# EAGLE board HSI-interface-2 (EAGLE 7.6.0)
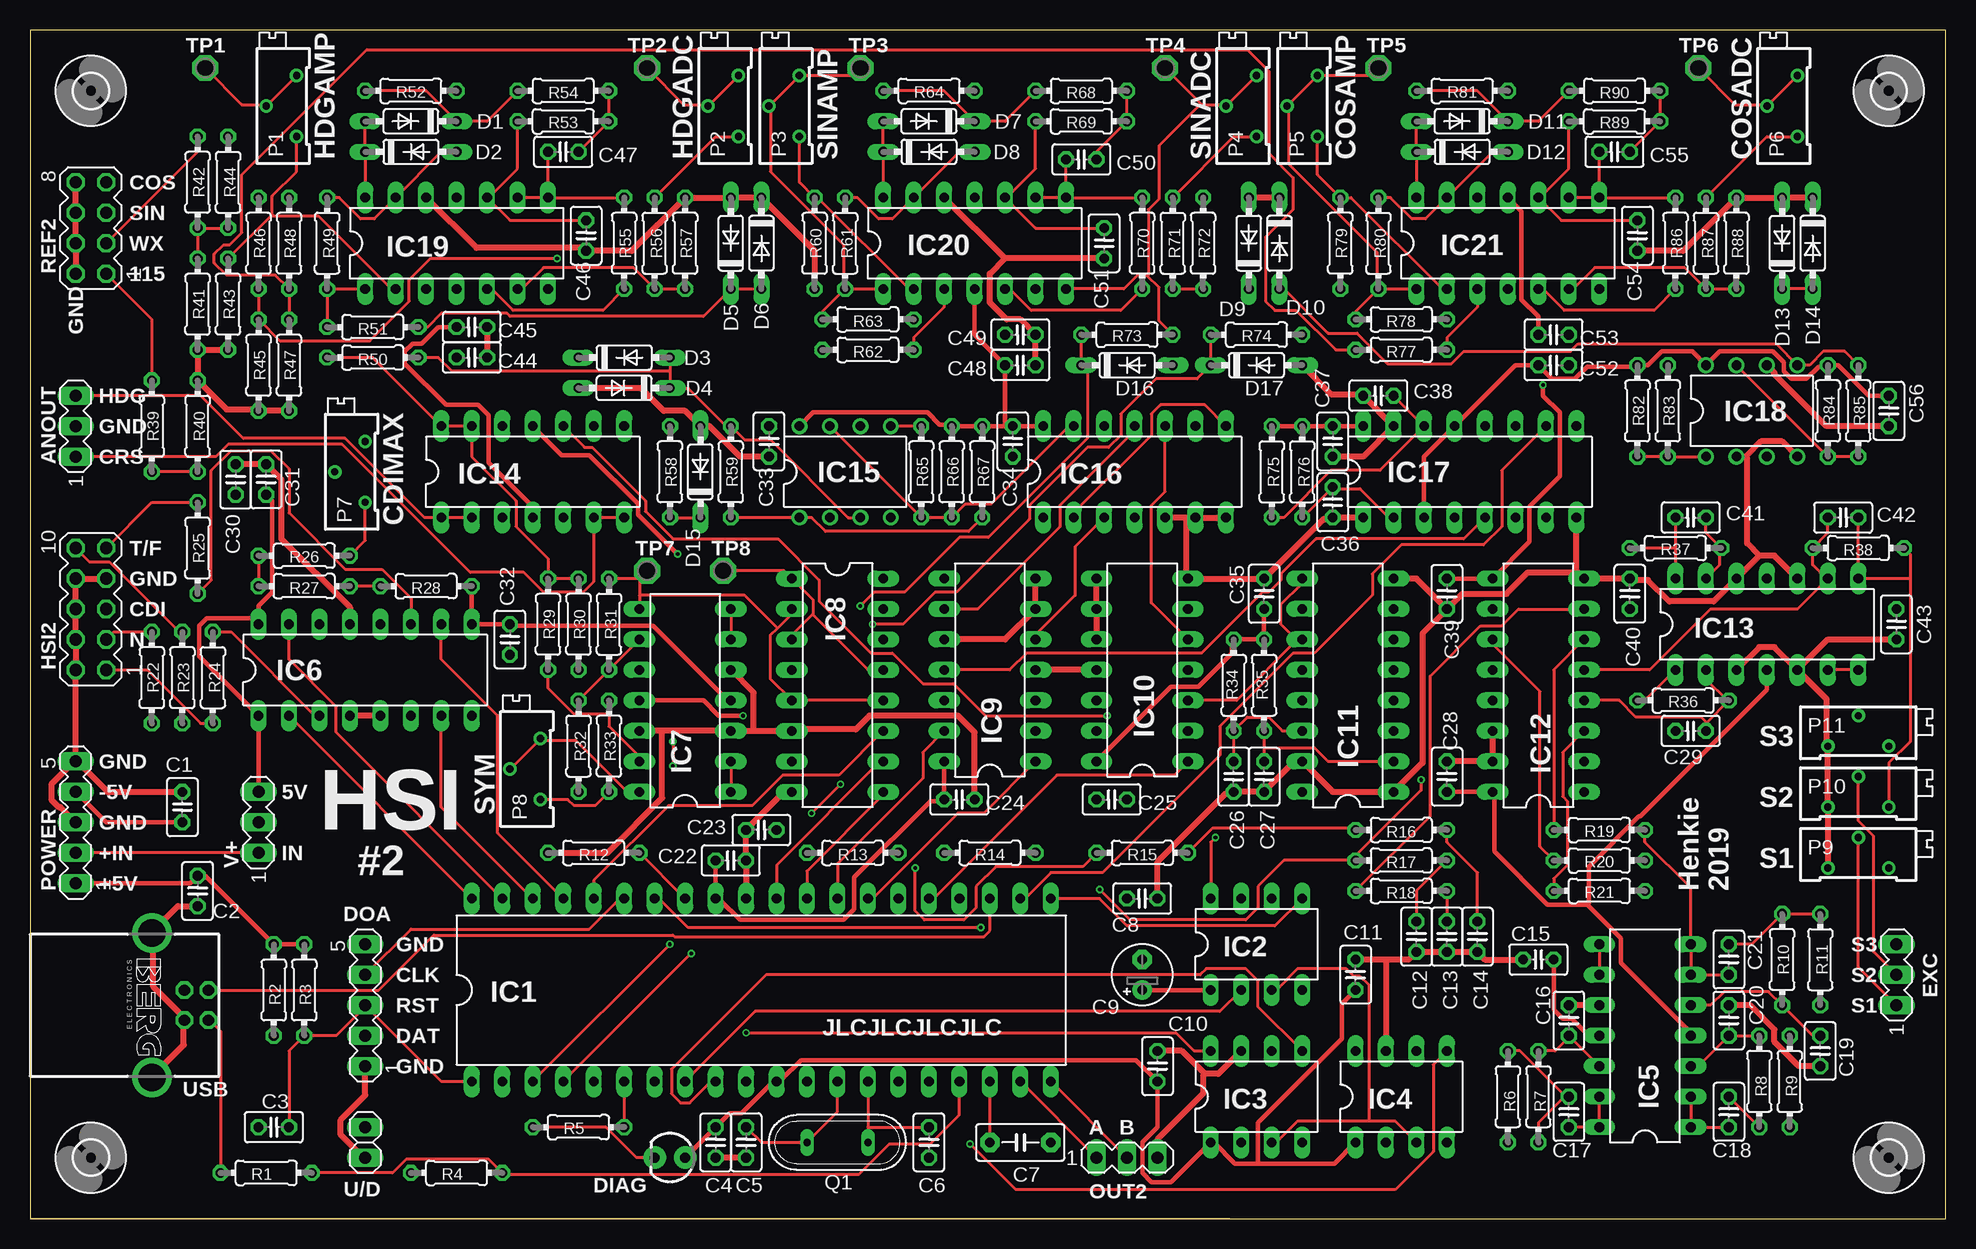
[diagram p7: board, top side]
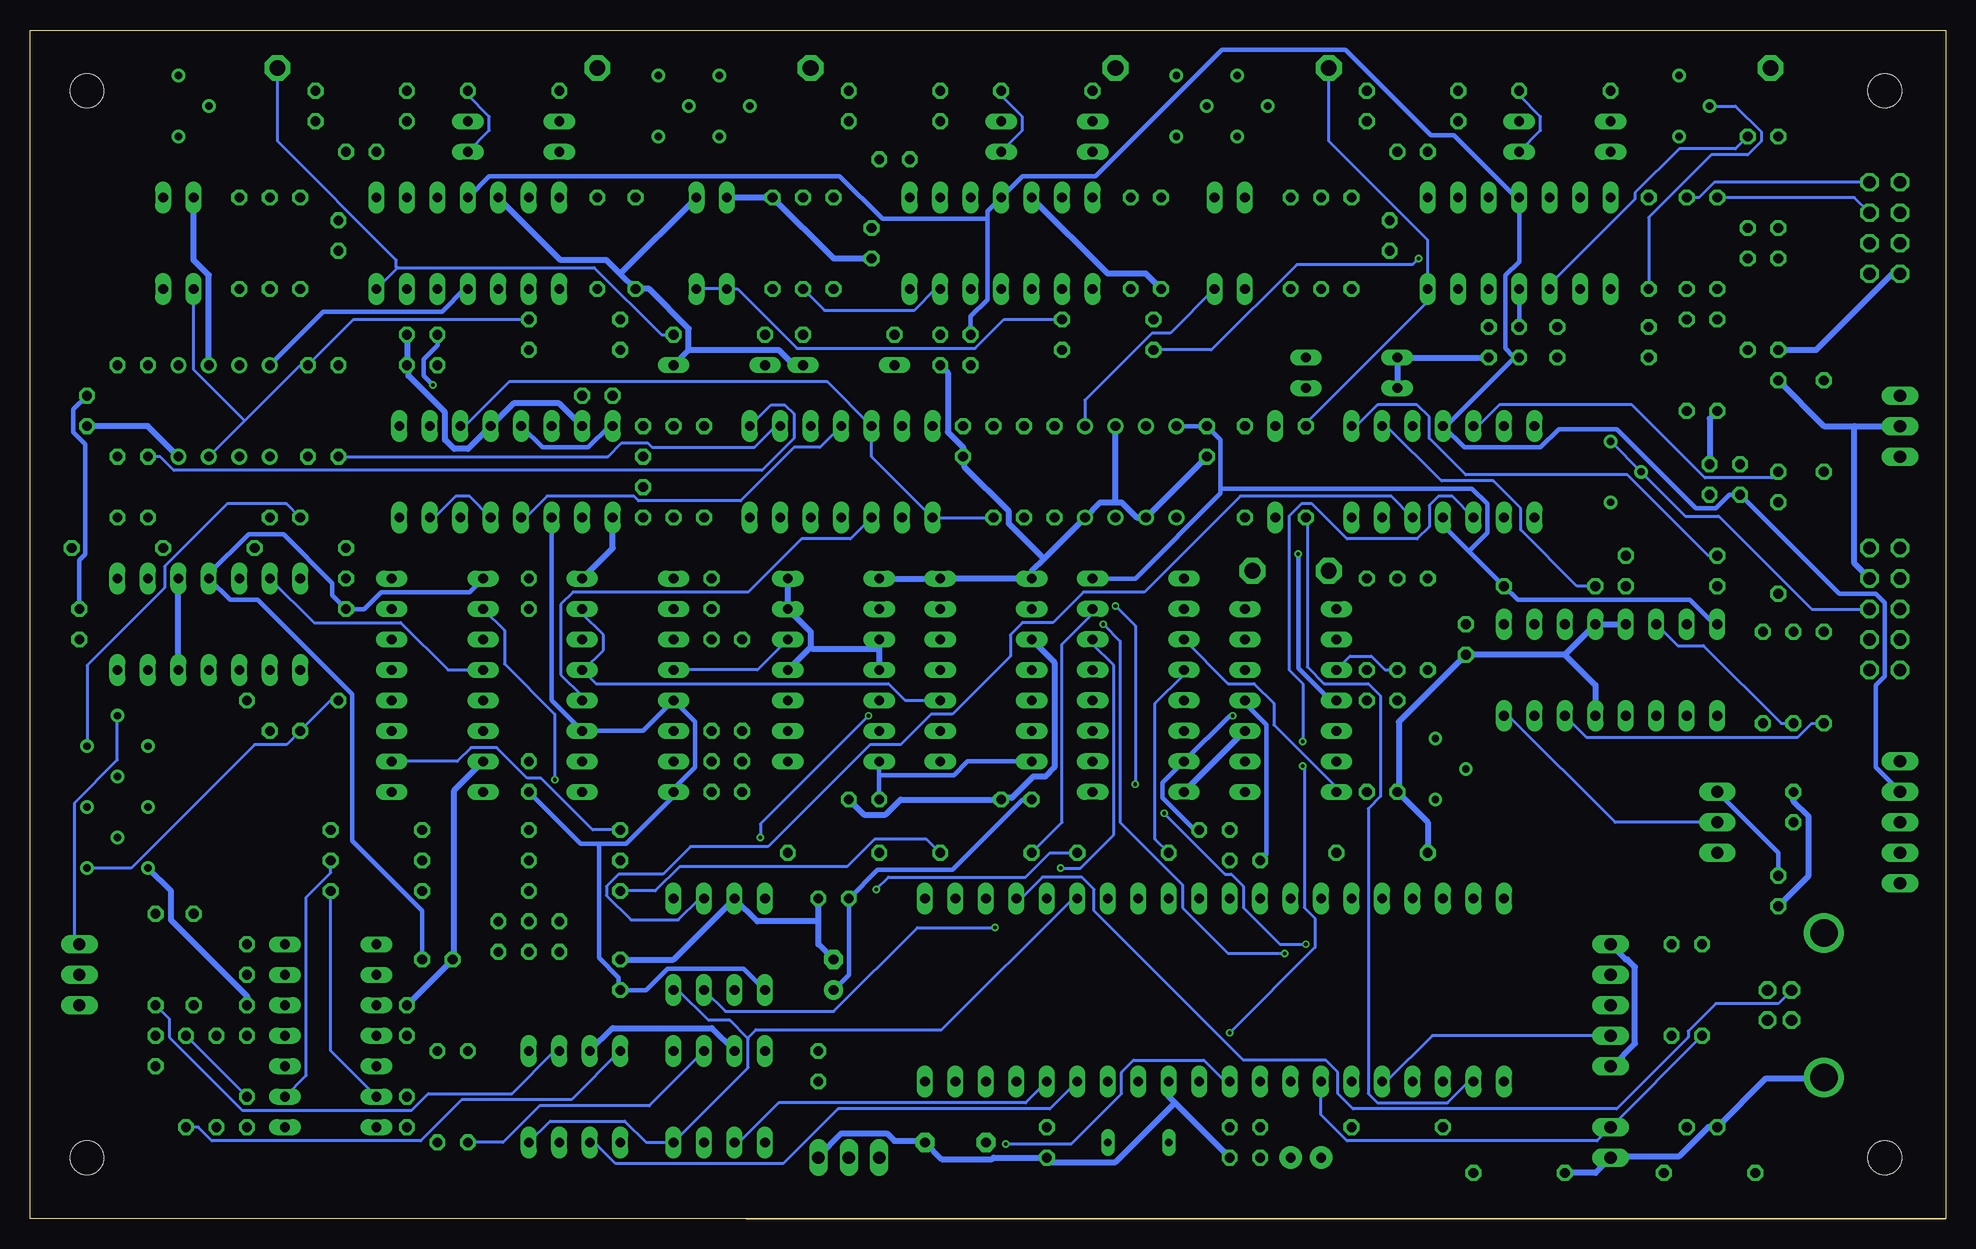
[diagram p8: board, bottom side, seen from below]

Size 159.69 x 99.06 mm. Coordinates in mm from the lower left corner, seen from the top.
Outline: 100,0 0,0
Outline: 0,0.01 159.69,0.01 159.69,99.06 0,99.06 0,0.01
Copper layers (1*16): Top 0.035mm / dielectric 1.5mm / Bottom 0.035mm
Design rules "ITEADstudio_DRC": minimum track width 6mil, minimum drill 12mil, track to track 6mil, track to pad 6mil, pad to pad 6mil, via to via 6mil, smd to smd 0mil, copper to edge 10mil, drill to drill 10mil, minimum pad ring 10mil, minimum via ring 6mil, stop-mask expansion 2mil, vias tented up to drill 100mil, thermal gap 10mil
Net classes: 0 default: width 0.254 mm, drill 0.254 mm, clearance 0.254 mm; 1 ground: width 0.508 mm, drill 0.254 mm, clearance 0.254 mm; 2 +5V: width 0.381 mm, drill 0.254 mm, clearance 0.254 mm; 3 -5V: width 0.381 mm, drill 0.254 mm, clearance 0.254 mm; 4 +12V: width 0.381 mm, drill 0.254 mm, clearance 0.254 mm; 5 -12V: width 0.381 mm, drill 0.254 mm, clearance 0.254 mm; 6 HV115: width 0.381 mm, drill 0.381 mm, clearance 0.508 mm; 7 +24V: width 0.381 mm, drill 0.381 mm, clearance 0.254 mm; 8 VIN: width 0.381 mm, drill 0.381 mm, clearance 0.254 mm

## Footprints (pad centres in the part's own frame; a part is rotated, then mirrored left to right if it is on the bottom)
MA03-1 = drill 1.016 long: 1 -2.54,0; 2 0,0; 3 2.54,0
C025-025X050 = drill 0.813 octagon: 1 -1.27,0; 2 1.27,0
C5B3 = drill 0.813 pad 1.6 octagon: 1 -2.54,0; 2 2.54,0
E2,5-5 = drill 0.813 pad 1.6: + -1.27,0 | drill 0.813 pad 1.6 octagon: - 1.27,0
DO35-7 = drill 0.813 long: A 3.81,0; C -3.81,0
LED3MM = drill 0.813 pad 1.88: A -1.27,0; K 1.27,0
MA05-1 = drill 1.016 long: 1 -5.08,0; 2 -2.54,0; 3 0,0; 4 2.54,0; 5 5.08,0
2,8 = hole 2.8: 0,0
MA05-2 = drill 1.016 octagon: 1 -5.08,-1.27; 2 -5.08,1.27; 3 -2.54,-1.27; 4 -2.54,1.27; 5 0,-1.27; 6 0,1.27; 7 2.54,-1.27; 8 2.54,1.27; 9 5.08,-1.27; 10 5.08,1.27
DIL40 = drill 0.813 long: 1 -24.13,-7.62; 2 -21.59,-7.62; 3 -19.05,-7.62; 4 -16.51,-7.62; 5 -13.97,-7.62; 6 -11.43,-7.62; 7 -8.89,-7.62; 8 -6.35,-7.62; 9 -3.81,-7.62; 10 -1.27,-7.62; 11 1.27,-7.62; 12 3.81,-7.62; 13 6.35,-7.62; 14 8.89,-7.62; 15 11.43,-7.62; 16 13.97,-7.62; 17 16.51,-7.62; 18 19.05,-7.62; 19 21.59,-7.62; 20 24.13,-7.62; 21 24.13,7.62; 22 21.59,7.62; 23 19.05,7.62; 24 16.51,7.62; 25 13.97,7.62; 26 11.43,7.62; 27 8.89,7.62; 28 6.35,7.62; 29 3.81,7.62; 30 1.27,7.62; 31 -1.27,7.62; 32 -3.81,7.62; 33 -6.35,7.62; 34 -8.89,7.62; 35 -11.43,7.62; 36 -13.97,7.62; 37 -16.51,7.62; 38 -19.05,7.62; 39 -21.59,7.62; 40 -24.13,7.62
DIL08 = drill 0.813 long: 1 -3.81,-3.81; 2 -1.27,-3.81; 3 1.27,-3.81; 4 3.81,-3.81; 5 3.81,3.81; 6 1.27,3.81; 7 -1.27,3.81; 8 -3.81,3.81
DIL14 = drill 0.813 long: 1 -7.62,-3.81; 2 -5.08,-3.81; 3 -2.54,-3.81; 4 0,-3.81; 5 2.54,-3.81; 6 5.08,-3.81; 7 7.62,-3.81; 8 7.62,3.81; 9 5.08,3.81; 10 2.54,3.81; 11 0,3.81; 12 -2.54,3.81; 13 -5.08,3.81; 14 -7.62,3.81
DIL16 = drill 0.813 long: 1 -8.89,-3.81; 2 -6.35,-3.81; 3 -3.81,-3.81; 4 -1.27,-3.81; 5 1.27,-3.81; 6 3.81,-3.81; 7 6.35,-3.81; 8 8.89,-3.81; 9 8.89,3.81; 10 6.35,3.81; 11 3.81,3.81; 12 1.27,3.81; 13 -1.27,3.81; 14 -3.81,3.81; 15 -6.35,3.81; 16 -8.89,3.81
DIL08' = drill 0.813 pad 1.27: 1 -3.81,-3.81; 2 -1.27,-3.81; 3 1.27,-3.81; 4 3.81,-3.81; 5 3.81,3.81; 6 1.27,3.81; 7 -1.27,3.81; 8 -3.81,3.81
RTRIM64Z = drill 0.61: 1 0,-2.54; 2 -2.54,0; 3 0,2.54
QS = drill 0.61 long: 1 -2.54,0; 2 2.54,0
0204/7 = drill 0.813 octagon: 1 -3.81,0; 2 3.81,0
MA04-2 = drill 1.016 octagon: 1 -3.81,-1.27; 2 -3.81,1.27; 3 -1.27,-1.27; 4 -1.27,1.27; 5 1.27,-1.27; 6 1.27,1.27; 7 3.81,-1.27; 8 3.81,1.27
P1-13 = drill 1.321 pad 2.159 octagon: TP 0,0
1X02 = drill 1.016 long: 1 -1.27,0; 2 1.27,0
PN61729-S = drill 0.95 octagon: 1 1.25,4.71; 2 -1.25,4.71; 3 -1.25,2.71; 4 1.25,2.71 | drill 2.3 pad 2.9: S1 -6.02,0; S2 6.02,0

## Placement (x,y rotation side)
ANOUT  ANOUT  [MA03-1]  3.81,66.05 90 top
C1  100n  [C025-025X050]  12.7,34.3 270 top
C2  100n  [C025-025X050]  13.97,27.32 90 top
C3  100n  [C025-025X050]  20.32,7.63 0 top
C4  100n  [C025-025X050]  57.15,6.36 90 top
C5  18p  [C025-025X050]  59.69,6.36 90 top
C6  18p  [C025-025X050]  74.93,6.36 90 top
C7  220n  [C5B3]  82.55,6.36 0 top
C8  100n  [C025-025X050]  92.71,26.68 180 top
C9  10µF  [E2,5-5]  92.71,20.33 90 top
C10  100n  [C025-025X050]  93.98,12.71 270 top
C11  100n  [C025-025X050]  110.49,20.33 270 top
C12  560p  [C025-025X050]  115.57,23.51 270 top
C13  560p  [C025-025X050]  118.11,23.51 270 top
C14  560p  [C025-025X050]  120.65,23.51 270 top
C15  100n  [C025-025X050]  125.73,21.6 0 top
C16  470n  [C025-025X050]  128.27,16.52 90 top
C17  470n  [C025-025X050]  128.27,8.9 270 top
C18  470n  [C025-025X050]  141.6,8.9 270 top
C19  470n  [C025-025X050]  149.22,13.98 270 top
C20  470n  [C025-025X050]  141.6,16.52 90 top
C21  470n  [C025-025X050]  141.6,21.6 270 top
C22  100n  [C025-025X050]  58.42,29.86 180 top
C23  100n  [C025-025X050]  60.96,32.39 0 top
C24  100n  [C025-025X050]  77.47,34.93 180 top
C25  100n  [C025-025X050]  90.17,34.93 180 top
C26  100n  [C025-025X050]  100.33,36.84 270 top
C27  100n  [C025-025X050]  102.87,36.84 270 top
C28  100n  [C025-025X050]  118.11,36.84 270 top
C29  470p  [C025-025X050]  138.43,40.65 180 top
C30  100n  [C025-025X050]  17.14,61.6 90 top
C31  100n  [C025-025X050]  19.68,61.6 270 top
C32  100n  [C025-025X050]  40.01,48.27 90 top
C33  100n  [C025-025X050]  61.59,64.78 90 top
C34  100n  [C025-025X050]  81.92,64.78 90 top
C35  100n  [C025-025X050]  102.87,52.08 270 top
C36  100n  [C025-025X050]  108.58,59.7 270 top
C37  100n  [C025-025X050]  108.58,64.78 90 top
C38  100n  [C025-025X050]  112.39,68.59 180 top
C39  100n  [C025-025X050]  118.11,52.08 90 top
C40  100n  [C025-025X050]  133.35,52.08 270 top
C41  470p  [C025-025X050]  138.43,58.43 180 top
C42  470p  [C025-025X050]  151.13,58.43 0 top
C43  100n  [C025-025X050]  155.57,49.54 90 top
C44  100n  [C025-025X050]  36.83,71.77 180 top
C45  100n  [C025-025X050]  36.83,74.31 180 top
C46  100n  [C025-025X050]  46.35,81.93 90 top
C47  100n  [C025-025X050]  44.45,88.91 180 top
C48  100n  [C025-025X050]  82.55,71.13 180 top
C49  100n  [C025-025X050]  82.55,73.67 180 top
C50  100n  [C025-025X050]  87.63,88.28 180 top
C51  100n  [C025-025X050]  89.53,81.29 90 top
C52  100n  [C025-025X050]  127,71.13 180 top
C53  100n  [C025-025X050]  127,73.67 180 top
C54  100n  [C025-025X050]  133.99,81.93 90 top
C55  100n  [C025-025X050]  132.08,88.91 180 top
C56  100n  [C025-025X050]  154.94,67.32 90 top
D1  1N4148  [DO35-7]  31.75,91.45 180 top
D2  1N4148  [DO35-7]  31.75,88.91 0 top
D3  1N4148  [DO35-7]  49.53,71.77 0 top
D4  1N4148  [DO35-7]  49.53,69.23 180 top
D5  1N4148  [DO35-7]  58.42,81.29 90 top
D6  1N4148  [DO35-7]  60.96,81.29 270 top
D7  1N4148  [DO35-7]  74.93,91.45 180 top
D8  1N4148  [DO35-7]  74.93,88.91 0 top
D9  1N4148  [DO35-7]  101.6,81.29 90 top
D10  1N4148  [DO35-7]  104.14,81.29 270 top
D11  1N4148  [DO35-7]  119.38,91.45 180 top
D12  1N4148  [DO35-7]  119.38,88.91 0 top
D13  1N4148  [DO35-7]  146.05,81.29 90 top
D14  1N4148  [DO35-7]  148.59,81.29 270 top
D15  1N4148  [DO35-7]  55.88,62.24 90 top
D16  1N4148  [DO35-7]  91.44,71.13 0 top
D17  1N4148  [DO35-7]  102.23,71.13 0 top
DIAG  LED  [LED3MM]  53.34,5.09 180 top
DOA  DOA  [MA05-1]  27.94,17.79 90 top
EXC  EXC  [MA03-1]  155.57,20.33 90 top
H1  MOUNT-HOLE2.8  [2,8]  154.94,5.09 0 top
H2  MOUNT-HOLE2.8  [2,8]  5.08,5.09 0 top
H3  MOUNT-HOLE2.8  [2,8]  154.94,93.99 0 top
H4  MOUNT-HOLE2.8  [2,8]  5.08,93.99 0 top
HSI2  HSI2  [MA05-2]  5.08,50.81 90 top
IC1  PIC18F4550_40  [DIL40]  60.96,19.06 0 top
IC2  MCP4822-E/P  [DIL08]  102.23,22.87 0 top
IC3  MCP4822-E/P  [DIL08]  102.23,10.17 0 top
IC4  MCP4822-E/P  [DIL08]  114.3,10.17 0 top
IC5  LM6484  [DIL14]  134.62,15.25 90 top
IC6  L293D  [DIL16]  27.94,45.73 0 top
IC7  LM6484  [DIL14]  54.61,43.19 90 top
IC8  4053N  [DIL16]  67.31,44.46 270 top
IC9  4013N  [DIL14]  80.01,45.73 90 top
IC10  4013N  [DIL14]  92.71,45.73 90 top
IC11  4538N  [DIL16]  109.86,44.46 90 top
IC12  SSM2164P  [DIL16]  125.73,44.46 90 top
IC13  LM6484  [DIL14]  144.78,49.54 0 top
IC14  LM6484  [DIL14]  41.91,62.24 0 top
IC15  LM393N  [DIL08']  67.94,62.24 0 top
IC16  4070N  [DIL14]  92.08,62.24 0 top
IC17  4538N  [DIL16]  120.02,62.24 0 top
IC18  LM393N  [DIL08']  143.51,67.32 0 top
IC19  LM6484  [DIL14]  35.56,81.29 0 top
IC20  LM6484  [DIL14]  78.74,81.29 0 top
IC21  LM6484  [DIL14]  123.19,81.29 0 top
OUT2  OUT2  [MA03-1]  91.44,5.09 0 top
P1  5k  [RTRIM64Z]  22.23,92.72 0 top
P2  50k  [RTRIM64Z]  59.05,92.72 0 top
P3  5k  [RTRIM64Z]  64.14,92.72 0 top
P4  50k  [RTRIM64Z]  102.23,92.72 0 top
P5  5k  [RTRIM64Z]  107.31,92.72 0 top
P6  50k  [RTRIM64Z]  147.32,92.72 0 top
P7  50k  [RTRIM64Z]  27.94,62.24 0 top
P8  2k  [RTRIM64Z]  42.55,37.48 0 top
P9  20k  [RTRIM64Z]  152.4,29.22 270 top
P10  20k  [RTRIM64Z]  152.4,34.3 270 top
P11  20k  [RTRIM64Z]  152.4,39.38 270 top
POWER  POWER  [MA05-1]  3.81,33.03 90 top
Q1  20MHz  [QS]  67.31,6.36 180 top
R1  1k  [0204/7]  19.68,3.82 0 top
R2  10k  [0204/7]  20.32,19.06 90 top
R3  10k  [0204/7]  22.86,19.06 90 top
R4  100k  [0204/7]  35.56,3.82 0 top
R5  470  [0204/7]  45.72,7.63 0 top
R6  150k  [0204/7]  123.19,10.17 270 top
R7  150k  [0204/7]  125.73,10.17 270 top
R8  150k  [0204/7]  144.15,11.44 270 top
R9  150k  [0204/7]  146.69,11.44 270 top
R10  150k  [0204/7]  146.05,21.6 90 top
R11  150k  [0204/7]  149.22,21.6 270 top
R12  100k  [0204/7]  46.99,30.49 180 top
R13  47k  [0204/7]  68.58,30.49 180 top
R14  47k  [0204/7]  80.01,30.49 180 top
R15  47k  [0204/7]  92.71,30.49 180 top
R16  560  [0204/7]  114.3,32.39 180 top
R17  560  [0204/7]  114.3,29.86 180 top
R18  560  [0204/7]  114.3,27.32 180 top
R19  2k7  [0204/7]  130.81,32.39 0 top
R20  2k7  [0204/7]  130.81,29.86 0 top
R21  2k7  [0204/7]  130.81,27.32 0 top
R22  15k  [0204/7]  10.16,45.09 90 top
R23  6k8  [0204/7]  12.7,45.09 90 top
R24  0  [0204/7]  15.24,45.09 270 top
R25  8k2  [0204/7]  13.97,55.89 90 top
R26  4k7  [0204/7]  22.86,55.25 0 top
R27  10k  [0204/7]  22.86,52.71 180 top
R28  12k  [0204/7]  33.02,52.71 180 top
R29  1k  [0204/7]  43.18,49.54 90 top
R30  1k  [0204/7]  45.72,49.54 90 top
R31  1k2  [0204/7]  48.26,49.54 270 top
R32  1k  [0204/7]  45.72,39.38 270 top
R33  560  [0204/7]  48.26,39.38 90 top
R34  33k  [0204/7]  100.33,44.46 270 top
R35  33k  [0204/7]  102.87,44.46 270 top
R36  47k  [0204/7]  137.79,43.19 0 top
R37  47k  [0204/7]  137.16,55.89 0 top
R38  47k  [0204/7]  152.4,55.89 180 top
R39  330k  [0204/7]  10.16,66.05 90 top
R40  6k8  [0204/7]  13.97,66.05 270 top
R41  1k  [0204/7]  13.97,76.21 90 top
R42  33k  [0204/7]  13.97,86.37 90 top
R43  1k  [0204/7]  16.51,76.21 90 top
R44  1k  [0204/7]  16.51,86.37 270 top
R45  1k  [0204/7]  19.05,71.13 90 top
R46  33k  [0204/7]  19.05,81.29 90 top
R47  1k  [0204/7]  21.59,71.13 90 top
R48  33k  [0204/7]  21.59,81.29 90 top
R49  10k  [0204/7]  24.77,81.29 270 top
R50  10k  [0204/7]  28.57,71.77 180 top
R51  10k  [0204/7]  28.57,74.31 180 top
R52  10k  [0204/7]  31.75,93.99 0 top
R53  150k  [0204/7]  44.45,91.45 0 top
R54  150k  [0204/7]  44.45,93.99 180 top
R55  10k  [0204/7]  49.53,81.29 90 top
R56  10k  [0204/7]  52.07,81.29 270 top
R57  10k  [0204/7]  54.61,81.29 90 top
R58  1k  [0204/7]  53.34,62.24 90 top
R59  2M2  [0204/7]  58.42,62.24 90 top
R60  1k  [0204/7]  65.41,81.29 90 top
R61  10k  [0204/7]  67.94,81.29 270 top
R62  1k  [0204/7]  69.85,72.4 180 top
R63  10k  [0204/7]  69.85,74.94 180 top
R64  10k  [0204/7]  74.93,93.99 0 top
R65  2M2  [0204/7]  74.3,62.24 90 top
R66  2k2  [0204/7]  76.83,62.24 90 top
R67  2k2  [0204/7]  79.38,62.24 90 top
R68  150k  [0204/7]  87.63,93.99 180 top
R69  150k  [0204/7]  87.63,91.45 0 top
R70  10k  [0204/7]  92.71,81.29 90 top
R71  10k  [0204/7]  95.25,81.29 270 top
R72  10k  [0204/7]  97.79,81.29 90 top
R73  1k  [0204/7]  91.44,73.67 0 top
R74  1k  [0204/7]  102.23,73.67 0 top
R75  47k  [0204/7]  103.5,62.24 270 top
R76  6k8  [0204/7]  106.05,62.24 270 top
R77  1k  [0204/7]  114.3,72.4 180 top
R78  10k  [0204/7]  114.3,74.94 180 top
R79  1k  [0204/7]  109.22,81.29 90 top
R80  10k  [0204/7]  112.39,81.29 270 top
R81  10k  [0204/7]  119.38,93.99 0 top
R82  2k2  [0204/7]  133.99,67.32 90 top
R83  2M2  [0204/7]  136.53,67.32 90 top
R84  2k2  [0204/7]  149.86,67.32 90 top
R85  2M2  [0204/7]  152.4,67.32 90 top
R86  10k  [0204/7]  137.16,81.29 90 top
R87  10k  [0204/7]  139.7,81.29 270 top
R88  10k  [0204/7]  142.24,81.29 90 top
R89  150k  [0204/7]  132.08,91.45 0 top
R90  150k  [0204/7]  132.08,93.99 180 top
REF2  REF2  [MA04-2]  5.08,82.56 90 top
TP1  TPSPAD1-13  [P1-13]  14.61,95.9 0 top
TP2  TPSPAD1-13  [P1-13]  51.44,95.9 0 top
TP3  TPSPAD1-13  [P1-13]  69.22,95.9 0 top
TP4  TPSPAD1-13  [P1-13]  94.61,95.9 0 top
TP5  TPSPAD1-13  [P1-13]  112.39,95.9 0 top
TP6  TPSPAD1-13  [P1-13]  139.06,95.9 0 top
TP7  TPSPAD1-13  [P1-13]  51.44,53.98 0 top
TP8  TPSPAD1-13  [P1-13]  57.78,53.98 0 top
U/D  U/D  [1X02]  27.94,6.36 90 top
USB  PN61729-S  [PN61729-S]  10.16,17.79 270 top
V+  V+  [MA03-1]  19.05,33.03 90 top

## Tracks (layer width: path | path; a pad name or v marks a point on that pad's centre or on a via)
+5V
  Top 0.381: C31.2 20.19,59.83 20.19,52.21 19.05,51.06 IC6.16 18.92,50.05 14.73,50.05 14.1,49.41 14.1,46.87 IC6.1 V+.3 | R3.2 R2.2 14.61,28.59 C2.2 13.34,27.95 POWER.1 | C34.2 R67.2 R66.2 76.71,66.18 75.82,66.18 74.8,67.19 65.28,67.19 IC15.8 | C34.2 IC16.14 | C34.2 81.28,66.18 C48.2 78.74,73.67 IC20.4 | C22.2 IC1.32 57.28,26.55 57.53,26.55 59.18,24.9 67.82,24.9 68.71,25.79 68.71,28.46 75.06,34.81 76.07,34.81 C24.2 IC9.14 | R28.1 IC6.9 C32.2 40.13,49.41 51.94,49.41 58.17,43.19 IC7.4 | C45.2 34.04,74.31 32.64,72.91 31.88,72.91 31.24,72.27 31.24,71.26 34.67,67.83 37.34,67.83 38.23,66.94 38.23,63 41.91,59.32 IC14.4 | C56.2 153.29,68.59 150.75,71.13 R84.2 149.73,71 149.1,71 148.08,69.99 146.81,69.99 146.18,70.62 146.18,71.38 145.29,72.27 140.84,72.27 IC18.8 138.56,72.27 136.02,72.27 134.87,71.13 R82.2 133.86,71 129.79,71 128.78,69.99 126.87,69.99 C52.2 123.83,71.13 IC17.13 116.2,63.51 IC17.3 | R75.1 R76.1 C37.2 IC17.16 | DIAG.A C4.2 58.29,8.77 59.31,8.77 61.98,11.44 IC1.11 62.36,11.57 62.61,11.57 64.26,13.22 92.2,13.22 C10.2 93.98,7.63 92.71,6.36 92.71,3.82 93.47,3.06 95.12,3.06 IC3.1 98.68,6.36 100.46,4.58 102.36,4.58 | 102.36,4.58 108.71,4.58 IC4.1 | C35.2 R35.1 R34.1 100.2,48.14 100.2,47.13 97.41,44.33 95.12,44.33 IC10.14 | C9.+ IC2.1 | C28.2 IC12.16 122.05,35.44 122.05,30.62 126.49,26.17 129.79,26.17 | IC5.4 138.43,15.5 132.59,21.35 132.59,23.38 129.79,26.17 | IC13.4 144.78,44.08 134.24,33.54 134.11,33.54 129.92,29.35 129.92,26.3 129.79,26.17 | 102.36,4.58 102.36,8.01 109.35,15 109.35,17.92 C11.2
  Bottom 0.381: V+.3 13.97,30.49 C2.2 | IC8.16 67.56,53.35 60.45,60.46 60.45,60.84 | 60.45,60.84 60.45,64.91 C33.2 IC15.8 | IC7.4 58.42,42.94 56.64,41.16 56.64,30.36 C22.2 | IC19.4 C45.2 | IC14.4 41.91,57.79 39.75,55.64 | 39.75,55.64 R28.1 35.69,51.57 21.34,51.57 19.3,49.54 IC6.16 | 60.45,60.84 39.5,60.84 38.23,59.57 38.23,57.16 39.75,55.64 | C43.2 155.57,54.87 155.07,55.38 155.07,64.53 156.08,65.54 156.08,67.45 C56.2 | IC21.4 123.44,77.48 125.35,75.58 135.25,75.58 IC18.8 | IC17.16 111.38,66.05 113.16,64.27 116.97,64.27 IC17.13 | IC10.14 88.9,36.97 | 88.9,36.97 C25.2 | IC9.14 81.53,38.11 82.68,36.97 88.9,36.97 | C9.+ 91.44,20.33 C8.2 89.03,29.09 82.8,29.09 76.96,34.93 C24.2 | IC2.1 100.2,20.84 106.55,20.84 108.33,19.06 C11.2 110.62,19.19 110.62,20.08 112.27,21.73 112.27,31.25 | 112.27,31.25 113.79,31.25 C28.2 | 112.27,31.25 109.98,31.25 106.17,35.06 106.17,35.44 IC11.16 106.05,35.82 104.27,37.6 104.27,41.41 IC11.13 108.58,40.65 IC11.3 116.2,43.19 IC17.3
+24V
  Top 0.254: V+.1 POWER.2
-5V  (via drill 0.3)
  Top 0.381: IC7.11 56.13,43.19 57.4,41.92 v59.44,41.92 | C1.2 6.35,33.03 POWER.4 | v53.98,55.38 50.67,58.68 50.67,59.57 46.61,63.64 44.32,63.64 IC14.11 | C53.2 125.73,75.19 124.33,76.59 124.33,83.96 IC21.11 | IC5.11 129.92,15.25 128.52,16.65 127.76,16.65 127,17.41 C15.2 | C39.2 IC12.9 124.97,56.4 124.97,59.32 127.51,61.86 127.51,67.19 126.11,68.59 v126.11,69.48
  Bottom 0.381: C23.2 62.61,32.39 65.28,35.06 65.28,36.33 IC8.7 59.69,41.92 v59.44,41.92 | POWER.4 5.84,37.6 5.84,44.46 5.08,45.22 5.08,51.32 5.84,52.08 8.89,52.08 C30.1 18.03,60.34 19.18,59.19 20.83,59.19 27.43,65.8 32.26,65.8 33.78,64.27 40.13,64.27 IC14.11 41.66,66.05 35.94,71.77 C44.2 36.07,71.89 36.7,72.53 36.7,78.62 35.56,79.77 IC19.11 35.69,85.23 35.94,85.23 41.02,90.31 42.93,90.31 50.04,97.42 60.33,97.42 70.87,86.88 76.96,86.88 IC20.11 79.88,83.96 79.88,83.32 | IC7.11 51.31,43.19 53.98,45.86 v53.98,55.38 | C49.2 81.28,75.19 79.88,76.59 79.88,83.32 | 79.88,83.32 88.65,83.32 92.2,86.88 121.41,86.88 IC21.11 | IC12.9 123.06,52.21 130.43,52.21 131.83,50.81 C40.2 134.49,51.95 134.49,52.97 138.56,57.03 141.48,57.03 144.78,53.73 IC13.11 143,51.57 140.72,51.57 132.84,43.7 132.84,31.51 127,25.66 C15.2 | C53.2 125.73,72.78 126.87,71.64 126.87,70.24 v126.11,69.48
CCOS
  Bottom 0.254: R48.2 20.57,85.1 19.3,86.37 REF2.7
CRSCOS  (via drill 0.3)
  Top 0.254: v55.12,22.11 IC1.4 | v70.23,49.54 72.77,49.54 75.44,52.21 77.22,52.21 83.31,58.3 83.31,59.45 88.14,64.27 89.92,64.27 90.93,65.29 90.93,67.07 93.85,69.99 97.28,69.99 D17.C R74.1
  Bottom 0.254: v55.12,22.11 59.82,22.11 63.63,25.92 63.63,27.82 68.83,33.03 68.83,48.14 v70.23,49.54
CRSPER
  Top 0.254: IC1.27 70.23,26.68 77.34,33.79 79.5,33.79 IC9.1
CRSQDT
  Top 0.254: IC1.25 75.31,26.68 85.6,36.97 95.38,36.97 IC10.1
CRSS1C
  Bottom 0.254: R6.2 120.27,6.36 117.22,9.41 108.08,9.41 IC3.6
CRSS1P
  Top 0.254: IC1.36 46.99,28.2 53.21,34.43 60.2,34.43 62.74,36.97 67.44,36.97 IC8.11
CRSS2C
  Bottom 0.254: IC4.6 115.95,13.98 119.51,10.42 126.49,10.42 127.89,9.03 141.99,9.03 148.08,15.12 148.08,16.65 R11.2
CRSS2P
  Top 0.254: IC1.30 62.23,29.47 70.87,38.11 IC8.10
CRSS3C
  Bottom 0.254: R9.2 145.67,7.63 144.53,6.49 127.13,6.49 123.7,9.92 114.55,9.92 IC4.8
CRSS3P
  Top 0.254: IC1.29 64.77,28.97 71.12,35.32 IC8.9
CRSSIN  (via drill 0.3)
  Top 0.254: v53.34,22.87 IC1.3 | v67.56,36.2 v65.15,33.79 | v69.22,51.06 70.36,52.21 72.9,52.21 77.47,56.78 79.88,56.78 88.14,65.03 88.14,70.62 D16.C R73.1
  Bottom 0.254: v53.34,22.87 55.5,22.87 58.55,25.92 58.55,27.7 59.56,28.71 60.07,28.71 v65.15,33.79 | v67.56,36.2 67.56,49.41 v69.22,51.06
CS1
  Bottom 0.254: IC3.2 100.58,6.36 97.28,9.66 76.71,9.66 IC1.16
CS2
  Top 0.254: IC1.8 60.45,17.28 99.19,17.28 IC2.2
CS3
  Bottom 0.254: IC4.2 112.65,6.36 110.87,4.58 96.9,4.58 92.33,9.15 74.68,9.15 IC1.15
CSIN
  Bottom 0.254: R46.2 7.62,85.1 REF2.5
DACCDI  (via drill 0.3)
  Top 0.254: IC2.8 98.42,31.38 v98.81,31.76 | v89.79,41.92 79.63,41.92 76.96,44.59 74.42,44.59 71.88,47.13 70.1,47.13 65.79,51.45 65.79,53.22 62.36,56.65 53.59,56.65 51.31,58.94 51.31,59.83 46.86,64.27 46.23,64.27 IC14.10
  Bottom 0.254: v98.81,31.76 98.81,32.9 v89.79,41.92
DACCRS
  Bottom 0.254: IC2.6 103.89,26.68 105.66,24.9 109.6,24.9 111.63,26.93 111.63,27.7 110.62,28.71 106.93,28.71 104.65,31 98.17,31 89.66,39.51 87.12,39.51 84.58,42.05 82.8,42.05 77.98,46.87 77.98,48.65 76.96,49.67 74.42,49.67 71.88,52.21 66.8,52.21 58.8,60.21 46.23,60.21 IC14.5
DACHDG  (via drill 0.3)
  Top 0.254: IC3.8 97.03,13.98 95.5,15.5 v59.69,15.5 | v53.59,39.76 v53.59,37.73
  Bottom 0.254: v59.69,15.5 52.58,22.62 52.58,25.03 53.47,25.92 53.47,37.6 v53.59,37.73 | v53.59,39.76 53.59,44.59 54.74,45.73 54.74,58.56 53.72,59.57 52.83,59.57 49.91,56.65 44.07,56.65 43.05,57.67 43.05,59.45 42.29,60.21 41.15,60.21 IC14.3
DOA_CLK
  Top 0.254: IC1.35 49.15,26.68 46.61,24.14 31.75,24.14 DOA.4
DOA_DAT
  Bottom 0.254: IC1.5 46.61,11.44 42.8,15.25 DOA.2
FROM_FLAG
  Top 0.254: IC6.10 34.29,46.62 38.99,41.92 38.99,32.14 IC1.37
GND
  Top 0.508: IC1.31 C22.1 C23.1 62.87,35.57 IC8.8 | 52.7,40.65 IC7.3 60.33,40.65 | 52.7,40.65 IC7.12 | 60.33,40.65 IC8.6 63.63,40.78 68.83,40.78 69.98,41.92 77.34,41.92 78.74,40.52 C24.1 | IC7.5 60.33,43.82 60.33,40.65 | IC6.5 IC6.4 | 52.7,40.65 52.7,35.06 48.13,30.49 R12.2 | C30.2 C31.1 20.95,61.6 20.95,56.65 26.67,50.94 IC6.13 | R47.1 R45.1 18.92,67.45 16.38,67.45 R40.1 R41.1 R43.1 | REF2.2 REF2.4 REF2.6 REF2.8 | HSI2.7 HSI2.8 HSI2.6 HSI2.4 HSI2.2 POWER.5 | C1.1 6.48,35.57 3.94,38.11 POWER.5 | POWER.3 2.54,34.3 2.41,34.3 1.78,34.93 1.78,36.2 3.68,38.11 POWER.5 | C2.1 12.32,26.05 10.16,23.89 USB.S1 10.29,23.63 10.29,19.31 12.83,16.77 USB.4 12.83,16.52 12.83,14.49 10.16,11.82 USB.S2 | DOA.1 27.94,10.3 25.91,8.27 25.91,7 27.81,5.09 U/D.1 | R60.1 65.41,80.66 D6.C D5.A R57.2 50.16,80.66 C46.1 46.1,80.91 37.21,80.91 IC19.12 | C37.1 111.12,63.51 IC17.15 C38.2 111,68.72 108.46,68.72 D17.A | D10.C D9.A | 81.28,80.02 IC20.12 | C51.1 81.28,80.02 | C5.1 C4.1 | C10.1 96.01,13.98 97.92,12.07 | 97.92,12.07 99.06,12.07 IC3.7 | OUT2.3 93.98,6.61 97.79,10.42 97.79,11.95 97.92,12.07 | C28.1 IC12.15 IC12.14 | IC5.10 C16.2 | 113.03,21.6 114.94,21.6 C12.2 C13.2 C14.2 121.28,21.6 C15.1 | 113.03,21.6 C11.1 | 113.03,21.6 IC4.7 | C8.1 93.98,29.73 99.69,35.44 100.2,35.44 C26.2 C27.2 105.41,38.11 IC11.15 108.58,35.57 IC11.1 116.08,37.98 116.08,48.78 C39.1 | D14.C D13.A R88.2 137.79,80.66 C54.1 | 143,63.51 IC18.2 | 143,63.51 144.27,64.78 146.05,64.78 IC18.4 | IC18.6 145.41,70.5 145.41,70.37 149.73,66.05 C56.1 | C20.2 143.38,17.79 145.41,15.76 145.41,14.74 147.45,12.71 C19.2 | IC12.8 C40.1 133.48,53.22 134.87,53.22 136.65,51.45 140.34,51.45 IC13.12 144.15,55.25
  Top 0.508: IC17.8 128.91,53.98 IC12.8 | P9.1 P10.1 P11.1 149.73,39.51 149.73,43.32 IC13.5 | 144.15,55.25 145.41,55.25 IC13.10 | IC13.3 144.15,47.63 145.41,47.63 IC13.5 | C43.1 149.86,48.27 IC13.5 | 144.15,55.25 143.13,56.27 143.13,63.38 143,63.51 | IC9.10 81.28,48.27 IC9.6 IC9.7 | IC10.11 IC9.4 | IC10.10 IC10.9 IC10.8 | IC17.1 C36.2 108.46,58.3 107.82,58.3 C35.1 IC10.7 96.39,53.48 96.39,58.43 | IC11.8 115.57,53.35 C39.1 | 96.39,58.43 IC16.6 IC16.7 | 96.39,58.43 IC16.5 | C45.1 C44.1 | C48.1 C49.1 82.55,74.94 81.41,74.94 80.01,76.34 80.01,78.75 81.28,80.02 | C33.1 59.18,63.51 56.64,66.05 D15.A 54.61,67.32 52.83,67.32 50.93,69.23 D4.A | C39.1 119.38,52.08 123.06,52.08 124.84,53.86 128.78,53.86 IC12.8
  Bottom 0.508: IC7.3 IC8.8 | R12.2 43.18,33.03 R32.2 45.59,35.7 45.59,41.41 C32.1 31.75,47 | 31.75,47 IC6.12 IC6.13 | IC6.5 29.21,44.46 31.75,47 | C31.1 19.68,66.69 R45.1 | 7.62,66.05 10.16,66.05 R40.1 | 7.62,66.05 ANOUT.2 | REF2.2 4.45,78.75 10.79,72.4 R41.1 | R4.1 29.21,3.82 U/D.1 27.81,5.22 22.23,5.22 19.81,7.63 C3.1 14.99,11.69 10.16,11.69 USB.S2 | DOA.5 26.67,21.6 26.54,21.6 25.91,20.96 25.91,14.62 27.81,12.71 DOA.1 | C1.1 12.7,34.81 11.43,33.54 11.43,28.59 C2.1 | 7.62,66.05 7.62,54.62 HSI2.7 | IC20.12 69.85,78.75 66.67,78.75 R60.1 | C53.1 C52.1 128.14,71 128.14,70.24 125.09,67.19 125.09,64.91 124.33,64.15 123.19,64.15 IC17.12 119.38,67.95 115.57,67.95 IC17.15 | C51.1 92.71,80.02 R72.2 D9.A | D16.A 96.01,71.13 97.28,72.4 104.78,72.4 | D17.A 104.78,72.4 | 104.78,72.4 104.78,74.18 108.08,77.48 R79.1 110.49,78.75 | IC21.12 115.44,79.89 111.63,79.89 110.49,78.75 | 110.49,78.75 D10.C | IC1.12 64.77,10.17 64.26,9.66 | C5.1 64.26,9.66 | OUT2.3 93.98,5.22 92.08,7.12 88.27,7.12 87.63,6.49 85.22,6.49 C7.2 83.69,4.96 79.5,4.96 79.38,5.09 C6.1 74.55,4.71 69.22,4.71 64.26,9.66 | 93.98,24.78 93.98,22.87 C9.- | 93.98,24.78 C8.1 | 93.98,24.78 99.06,24.78 IC2.7 106.05,21.6 C11.1 | C16.2 C15.1 124.33,21.73 124.33,35.7 IC12.15 | IC3.7 102.87,15.88 111.12,15.88 IC4.7 | C56.1 149.86,66.05 IC18.4 | D13.A 146.05,79.89 144.78,78.62 IC18.6 | IC13.5 IC13.10 | C20.2 141.6,18.55 147.96,24.9 147.96,27.32 P9.1 | C25.1 90.17,33.66 88.39,33.66 87.12,34.93 C24.1 78.61,35.06 77.85,35.06 76.07,36.84 75.06,36.84 74.3,37.6 74.3,46.36 IC9.10 | IC10.10 88.9,47.51 | 88.9,47.51 IC10.11 | IC10.8 IC9.7 IC9.8 76.2,53.98 75.18,55 | IC17.1 111.12,55.89 IC11.8
  Bottom 0.508: 94.61,47.63 IC10.4 | 94.61,47.63 94.61,48.91 IC10.6 IC10.7 | 88.9,47.51 94.49,47.51 94.61,47.63 | D4.A D3.C C44.1 | C48.1 83.19,70.5 83.19,65.54 81.92,64.27 C34.1 81.79,63.38 81.79,62.62 78.11,58.94 78.11,57.92 75.18,55 | 75.18,55 IC15.4 70.48,59.7 69.22,59.7 | 69.22,59.7 68.71,59.7 67.44,58.43 IC15.2 C33.1 | 69.22,59.7 IC15.6
HDG000
  Top 0.254: IC1.28 67.31,29.6 74.42,36.71 74.42,38.87 IC9.13
HDGSIG
  Top 0.254: R58.1 D15.C
  Bottom 0.254: IC1.2 39.75,11.44 41.53,9.66 47.37,9.66 48.13,10.42 48.13,34.17 47.12,35.19 47.12,43.57 48.13,44.59 51.82,44.59 53.21,45.98 53.21,58.3 R58.1
LDAC1
  Top 0.254: IC1.9 56.77,11.44 54.99,9.66 54.23,9.66 53.47,10.42 53.47,12.46 61.34,20.33 97.54,20.33 98.04,20.84 101.35,20.84 102.36,19.82 102.36,17.66 IC3.5
LDAC2
  Top 0.254: IC1.21 89.15,26.68 91.44,24.39 103.76,24.39 IC2.5
LDAC3  (via drill 0.3)
  Top 0.254: v78.36,6.23 82.17,2.42 113.79,2.42 116.97,5.6 116.97,12.84 IC4.5
  Bottom 0.254: IC1.10 60.07,11.44 61.85,13.22 67.69,13.22 68.71,12.2 68.71,10.42 72.9,6.23 v78.36,6.23
MCLR
  Top 0.254: C3.2 21.59,13.98 R3.1 25.53,15.25 27.94,17.66 DOA.3 34.29,11.44 IC1.1
N$1
  Top 0.254: OUT2.2 IC1.20
N$2
  Top 0.254: OUT2.1 IC1.19
N$3
  Top 0.254: IC9.11 81.66,45.73 83.06,47.13 97.66,47.13 102.74,52.21 103.25,52.21 104.27,53.22 104.27,53.73 107.19,56.65 119.51,56.65 IC17.5
  Bottom 0.254: IC17.7 125.98,58.43 124.21,60.21 123.06,60.21 IC17.5
N$4
  Bottom 0.254: IC19.3 33.02,77.86 25.91,84.97 25.91,85.48 22.23,89.16 17.53,89.16 R44.1
N$5
  Top 0.254: R42.2 13.97,88.91 REF2.3
N$6
  Top 0.254: P8.1 44.83,34.93 45.34,34.43 47.12,34.43 R33.1
N$7
  Top 0.254: R40.2 R39.1
  Bottom 0.254: IC14.12 38.99,66.05 37.21,67.83 26.16,67.83 20.07,61.73 14.48,61.73 R40.2
N$8
  Top 0.254: R22.2 6.99,48.91 HSI2.3
N$9
  Top 0.254: R24.2 14.22,41.28 9.78,45.73 HSI2.1
N$10
  Top 0.254: R26.1 R27.2
  Bottom 0.254: IC14.8 49.15,66.05 47.37,67.83 44.07,67.83 43.05,66.81 43.05,65.03 40.01,61.99 26.54,61.99 19.81,55.25 R26.1
N$11
  Bottom 0.254: P7.3 P7.2 21.72,58.56 18.92,58.56 11.18,50.81 HSI2.5
N$12
  Top 0.254: IC14.7 IC14.6 46.99,53.1 46.1,52.21 42.8,52.21 41.15,53.86 36.7,53.86 26.04,64.53 16.51,64.53 15.49,63.51 ANOUT.1
N$13  (via drill 0.3)
  Top 0.254: R46.1 R45.2 20.83,73.16 28.32,73.16 31.62,76.46 31.62,78.24 33.4,80.02 v43.94,80.02
  Bottom 0.254: R62.2 61.21,72.4 54.1,79.51 44.45,79.51 v43.94,80.02
N$14
  Top 0.254: P3.1 64.14,86.37 R60.2 65.66,85.1 73.28,77.48 IC20.2
N$15
  Top 0.254: R63.2 66.04,75.58 R61.2 | R61.2 IC20.1 | TP3.TP 68.58,95.26 P3.3 P3.2 61.72,92.72 61.72,87.26 67.82,81.16 67.82,77.48 R61.2
N$16
  Top 0.254: IC20.14 D8.C D7.A
N$17
  Top 0.254: R61.1 68.96,85.1 70.74,83.32 71.88,83.32 IC20.13 77.47,88.91 D8.A
  Bottom 0.254: R64.2 78.74,93.61 76.96,91.83 76.96,90.69 D8.A
N$18
  Top 0.254: R68.2 81.28,91.45 D7.C 76.2,93.99 R64.1
N$19
  Top 0.254: C50.1 88.9,88.91 R69.2 R68.1
N$20
  Top 0.254: C51.2 83.82,82.56 IC20.10 81.41,85.1 83.82,87.51 R69.1
N$21
  Top 0.254: IC20.8 IC20.9 | IC20.8 C50.2 | IC20.8 R70.2
N$22
  Top 0.254: R5.1 48.01,7.63 50.55,5.09 DIAG.K
N$23
  Top 0.254: IC20.5 81.66,77.48 83.44,75.7 90.93,75.7 R70.1
N$24
  Top 0.254: IC1.6 R5.2
N$25
  Top 0.254: R23.2 12.45,48.91 6.6,54.75 4.95,54.75 HSI2.10
N$26
  Top 0.254: R71.2 R72.1
  Bottom 0.254: IC20.6 84.2,77.48 85.98,75.7 93.47,75.7 R71.2
N$27
  Bottom 0.254: R23.1 13.72,41.28 20.19,47.76 22.35,47.76 IC6.14
N$28
  Top 0.254: R25.2 10.16,59.7 HSI2.9
N$29
  Top 0.254: IC9.9 78.99,50.81 85.85,57.67 85.85,59.45 92.08,65.67 IC16.11
  Bottom 0.254: IC17.4 118.36,58.43 116.59,60.21 109.35,60.21 108.97,59.83 100.46,59.83 96.01,64.27 93.85,64.27 IC16.11
N$30
  Top 0.254: P4.1 100.33,90.18 R71.1
N$31
  Top 0.254: R47.2 R48.1 20.45,78.62 16.38,78.62 15.37,79.64 15.37,80.4 16.13,81.16 16.64,81.16 17.65,82.18 17.65,87.01 28.07,97.42 101.47,97.42 103.25,95.64 103.25,88.78 105.28,86.75 105.28,84.08 103,81.8 103,76.46 103.76,75.7 105.54,75.7 108.84,72.4 R77.2
N$32
  Top 0.254: R62.1 73.66,73.42 76.2,75.96 IC20.3
N$33
  Top 0.254: P5.1 107.31,87.01 R79.2 110.11,85.1 117.73,77.48 IC21.2
N$34
  Bottom 0.254: R22.1 11.18,41.28 12.32,40.14 29.97,40.14 IC6.6
N$35
  Top 0.254: R28.2 R27.1
  Bottom 0.254: IC14.9 46.61,66.05 42.04,61.48 37.72,61.48 35.43,59.19 35.43,57.41 30.73,52.71 R28.2
N$36
  Top 0.254: IC6.3 23.75,41.92 16.76,48.91 R24.1
N$37
  Top 0.254: R85.2 151.26,72.27 149.48,72.27 148.34,71.13 IC18.5 145.54,72.91 129.03,72.91 128.4,72.27 119.51,72.27 118.49,71.26 113.16,71.26 110.62,73.8 108.2,73.8 104.52,77.48 D10.A
  Bottom 0.254: R63.1 78.49,74.94 80.9,72.53 95.76,72.53 100.71,77.48 D9.C D10.A
N$38
  Top 0.254: R41.2 R42.1 R44.2
N$39
  Top 0.254: IC16.10 94.61,60.59 93.47,59.45 93.47,51.32 IC10.5
  Bottom 0.254: IC11.12 99.06,45.73 IC10.5
N$40
  Top 0.254: P1.1 22.23,87.26 20.19,85.23 20.19,83.7 20.13,83.64 | R43.2 20.13,83.64 | IC19.2 30.1,77.48 24,83.58 20.19,83.58 20.13,83.64
N$41
  Top 0.254: R51.2 R49.2 IC19.1 | P1.3 P1.2 19.68,92.85 17.65,92.85 TP1.TP
  Bottom 0.254: R49.2 24.77,83.45 19.56,88.66 16.51,88.66 15.37,89.8 15.37,90.56 17.53,92.72 P1.2
N$42
  Top 0.254: IC19.14 D2.C D1.A
N$43
  Top 0.254: R49.1 25.78,85.1 27.56,83.32 28.7,83.32 IC19.13 34.29,88.91 D2.A
  Bottom 0.254: R52.2 35.56,93.61 33.78,91.83 33.78,90.69 D2.A
N$44
  Top 0.254: R54.2 38.1,91.45 D1.C 33.02,93.99 R52.1
N$45
  Top 0.254: C47.1 R53.2 R54.1
N$46
  Top 0.254: C46.2 40.01,83.2 IC19.10 38.23,85.1 40.64,87.51 R53.1
N$47
  Top 0.254: IC19.8 IC19.9 | IC19.8 R55.2 | IC19.8 C47.2
N$48
  Top 0.254: IC19.5 38.48,77.48 40.26,75.7 47.75,75.7 R55.1
N$49
  Top 0.254: IC19.6 41.02,77.48 42.8,79.26 50.29,79.26 R56.2 R57.1
N$50
  Top 0.254: P2.1 57.15,90.18 R56.1
N$51
  Top 0.254: R78.2 110.49,75.58 R80.2 | R80.2 IC21.1 | TP5.TP 111.76,95.26 P5.3 P5.2 104.9,92.72 104.9,87.89 112.27,80.53 112.27,77.48 R80.2
N$52
  Top 0.254: R65.2 IC15.5 | R51.1 33.15,74.31 34.29,75.45 39.75,75.45 40.01,75.19 56.13,75.19 D5.C D6.A
  Bottom 0.254: IC15.5 71.75,68.21 66.17,73.8 64.64,73.8 D6.A
N$53
  Top 0.254: IC9.5 83.82,48.65 87.12,51.95 87.12,56.02 IC16.3
  Bottom 0.254: IC11.4 113.67,43.57 115.44,45.35 115.44,51.19 114.43,52.21 99.82,52.21 95.38,56.65 91.31,56.65 IC16.3
N$54
  Bottom 0.254: IC9.3 86.74,43.19 88.14,44.59 112.52,44.59 IC11.5 113.54,45.73 111.89,47.38 111.89,48.65 113.67,50.43 IC11.7
N$55
  Top 0.254: D3.A 53.34,70.62 | 53.34,70.62 D4.C 54.86,69.23 58.04,66.05 R59.2 59.56,64.91 61.72,64.91 68.2,58.43 IC15.3 | R50.1 34.04,71.77 35.18,70.62 53.34,70.62
N$56
  Top 0.254: IC21.14 D12.C D11.A
N$57
  Top 0.254: R75.2 104.52,58.43 108.46,62.37 112.52,62.37 IC17.14 C38.1
N$58
  Top 0.254: R1.1 15.88,15.63 14.99,16.52 USB.1
N$59
  Top 0.254: R80.1 113.41,85.1 115.19,83.32 116.33,83.32 IC21.13 121.92,88.91 D12.A
  Bottom 0.254: R81.2 123.19,93.61 121.41,91.83 121.41,90.69 D12.A
N$60
  Top 0.254: R1.2 30.23,3.82 31.37,4.96 38.23,4.96 R4.2 39.5,3.69 69.09,3.69 71.63,6.23 75.06,6.23 77.47,8.65 IC1.17
N$61
  Top 0.254: IC1.14 69.85,7.63 | 69.85,7.63 Q1.1 | 69.85,7.63 C6.2
N$62
  Top 0.254: R76.2 C36.1 108.58,60.84 110.87,60.84 113.28,58.43 IC17.2
N$63
  Top 0.254: R90.2 125.73,91.45 D11.C 120.65,93.99 R81.1
N$64
  Top 0.254: P7.1 27.94,56.52 R26.2
N$65
  Top 0.254: IC10.3 100.58,43.19 105.66,48.27 IC11.11 105.54,48.27 104.27,49.54 104.27,51.19 106.05,52.97 IC11.9
N$66
  Top 0.254: C55.1 R89.2 R90.1
N$67
  Top 0.254: C54.2 127.64,83.2 IC21.10 125.86,85.1 128.27,87.51 R89.1
N$68
  Top 0.254: IC21.8 IC21.9 | IC21.8 C55.2 | IC21.8 R86.2
N$69
  Top 0.254: IC21.5 126.11,77.48 127.89,75.7 135.38,75.7 R86.1
N$70
  Top 0.254: IC21.6 128.65,77.48 130.43,79.26 137.92,79.26 R87.2 R88.1
N$71
  Top 0.254: P6.1 144.78,90.18 R87.1
N$72
  Top 0.254: R77.1 118.11,73.42 120.65,75.96 IC21.3
N$73
  Top 0.254: D14.A D13.C
  Bottom 0.254: IC18.3 141.8,66.49 | 141.8,66.49 137.16,71.13 R83.2 132.72,74.94 R78.1 | D13.C 146.05,70.75 141.8,66.49
N$74
  Top 0.254: R35.2 102.87,39.25 | 102.87,39.25 C27.1 | IC11.2 108.2,38.11 107.06,39.25 102.87,39.25
N$75
  Top 0.254: C26.1 R34.2 101.47,41.79 103.25,41.79 104.39,40.65 IC11.14
N$76
  Top 0.254: P2.3 P2.2 56.52,92.85 54.48,92.85 TP2.TP
  Bottom 0.254: R58.2 53.34,66.3 43.18,76.46 IC19.7 43.18,81.54 51.44,89.8 TP2.TP
N$77
  Top 0.254: R15.1 98.55,32.52 110.36,32.52 R16.2
  Bottom 0.254: IC12.2 124.08,38.11 122.94,39.25 120.78,39.25 118.24,36.71 117.09,36.71 112.78,32.39 R16.2
N$78
  Top 0.254: R16.1 118.11,31.38 120.65,28.84 C14.1
N$79
  Top 0.254: C29.1 139.7,41.28 139.76,41.35 | 139.76,41.35 R36.2 141.48,43.19 139.7,44.97 IC13.2 | IC12.4 132.46,43.19 133.86,41.79 139.32,41.79 139.76,41.35
N$80
  Top 0.254: IC14.2 IC14.1 32.89,58.43 26.29,65.03 17.78,65.03 14.22,68.59 ANOUT.3
N$81
  Top 0.254: R36.1 134.62,43.19 IC13.1
  Bottom 0.254: P9.3 151.26,29.22 140.97,39.51 138.3,39.51 C29.2 134.62,43.19 R36.1
N$82
  Top 0.254: C17.2 IC5.14 IC5.13
  Bottom 0.254: R21.2 134.62,13.98 IC5.13
N$83
  Top 0.254: R21.1 127,28.33 128.14,29.47 128.14,34.81 127.76,35.19 127.76,38.87 IC12.3
N$84
  Top 0.254: C5.2 60.96,6.36 Q1.2 67.31,8.9 IC1.13
N$85
  Top 0.254: IC5.12 C16.1 128.27,15.12 127.13,13.98 R7.1
N$86
  Top 0.254: R6.1 124.21,13.98 128.02,10.17 C17.1 127.89,10.17 125.73,8.01 R7.2
N$87
  Top 0.254: IC12.5 135,45.73 140.08,50.81 147.32,50.81 IC13.9 149.73,53.35 148.59,54.49 R38.2 149.86,57.16 C42.1
N$88
  Top 0.254: P10.3 154.94,37.98 156.72,39.76 156.72,53.35 | 156.72,53.35 156.72,55.38 R38.1 | 156.72,53.35 IC13.8 C42.2
N$89
  Top 0.254: R19.1 127,45.73 IC12.6
N$90
  Top 0.254: IC12.7 124.08,50.81 122.68,49.41 120.9,49.41 116.71,45.22 116.71,33.54 R18.2
  Bottom 0.254: R18.2 107.57,27.32 105.54,29.35 91.57,29.35 89.28,31.63 84.96,31.63 R14.1
N$91
  Top 0.254: R18.1 C13.1
N$92
  Top 0.254: C21.2 IC5.6 IC5.7 138.43,27.57 134.62,31.38 R19.2
N$93
  Top 0.254: C21.1 143.51,22.87 R10.2 R11.1
N$94
  Top 0.254: C19.1 148.59,15.25 R10.1 144.91,18.93 141.22,18.93 140.08,17.79 IC5.5
N$95
  Top 0.254: C41.1 139.7,57.16 R37.2 140.84,55.89 140.84,54.49 IC13.13
  Bottom 0.254: IC12.12 124.84,45.73 128.78,49.67 136.02,49.67 IC13.13
N$96
  Top 0.254: C7.1 IC1.18
N$97
  Top 0.254: C41.2 137.16,55.89 | 137.16,55.89 IC13.14 | 137.16,55.89 R37.1
  Bottom 0.254: P11.3 154.94,46.11 148.46,52.59 148.46,54.37 143.26,59.57 138.3,59.57 C41.2
N$98  (via drill 0.3)
  Top 0.254: v115.95,36.59 115.95,35.7 110.49,30.24 R17.2 104.52,29.86 102.36,27.7 102.36,25.92 101.35,24.9 91.69,24.9 v89.15,27.44
  Bottom 0.254: v115.95,36.59 115.95,42.05 120.14,46.24 120.14,49.03 IC12.10 | R13.1 74.68,30.49 76.71,28.46 88.14,28.46 v89.15,27.44
N$99
  Top 0.254: IC12.11 121.92,47.89 125.86,43.95 125.86,31 R20.1
N$100
  Top 0.254: C12.1 115.57,27.32 R17.1
N$101
  Top 0.254: IC5.2 IC5.1 C18.2
  Bottom 0.254: R20.2 134.62,28.84 136.65,26.81 136.65,11.95 IC5.2
N$102
  Top 0.254: C18.1 R8.2
  Bottom 0.254: C18.1 R9.1
N$103
  Top 0.254: IC5.3 139.06,12.71 C20.1 R8.1
N$104
  Bottom 0.254: IC8.15 71.12,50.43 73.66,47.89 73.66,33.03 R14.2
N$105  (via drill 0.3)
  Top 0.254: v73.79,29.22 73.79,25.66 74.55,24.9 77.85,24.9 78.87,25.92 78.87,27.7 80.52,29.35 87.76,29.35 R15.2
  Bottom 0.254: IC8.14 71.12,47.89 69.34,46.11 69.34,32.01 72.14,29.22 v73.79,29.22
N$106
  Bottom 0.254: IC8.4 63.5,45.35 65.91,42.94 65.91,31.63 R13.2
N$107
  Top 0.254: IC7.2 IC7.1
N$108
  Top 0.254: IC7.13 50.8,38.49 48.26,41.03 48.26,42.05 | R33.2 48.26,42.05 | R29.1 43.18,44.21 45.34,42.05 48.26,42.05
N$109
  Top 0.254: R32.1 R31.2 IC7.9
N$110
  Top 0.254: 50.8,53.35 50.8,51.95 | 50.8,51.95 IC7.8 | 50.8,53.35 R31.1 | 50.8,53.35 TP7.TP | IC8.12 IC8.5 61.72,44.97 61.72,48.65 62.29,49.22 | IC8.2 63.5,50.43 62.29,49.22 | 50.8,51.95 59.56,51.95 62.29,49.22
N$111
  Top 0.254: P8.2 P8.3 42.55,39.89 45.47,39.89 49.78,35.57 IC7.14 | IC8.3 63.5,48.65 65.22,50.36 | 65.22,50.36 65.28,50.43 65.28,51.57 IC8.1 62.87,53.98 TP8.TP | IC8.13 69.85,45.73 65.22,50.36
  Bottom 0.254: IC7.14 50.8,35.95 56.01,41.16 56.01,42.94 57.66,44.59 59.82,44.59 IC8.3
N$112
  Top 0.254: IC7.7 IC7.6
N$113
  Bottom 0.254: R30.1 46.74,45.73 47.88,46.87 49.66,46.87 IC7.10
N$114
  Top 0.254: IC13.7 IC13.6
N$115
  Top 0.254: IC5.8 IC5.9
N$116
  Top 0.254: P9.2 152.4,20.96 EXC.1
N$117
  Top 0.254: P10.2 152.4,33.16 153.67,31.89 153.67,22.24 EXC.2
N$118
  Bottom 0.254: P11.2 152.4,38.24 155.96,34.68 155.96,23.25 EXC.3
N$119
  Top 0.254: P6.3 P6.2 144.78,92.85 142.11,92.85 TP6.TP
  Bottom 0.254: R74.2 107.06,73.67 112.65,79.26 129.03,79.26 129.09,79.19 | IC21.7 129.09,79.19 | TP6.TP 139.06,89.8 129.16,79.89 129.16,79.26 129.09,79.19
N$120
  Top 0.254: IC20.7 91.19,77.48 92.33,78.62 93.09,78.62 93.15,78.56 | 93.15,78.56 94.11,77.61 94.11,74.81 R73.2 | P4.3 P4.2 99.69,92.85 97.66,92.85 97.6,92.91 | TP4.TP 97.6,92.91 | 97.6,92.91 94.11,89.42 94.11,84.97 93.22,84.08 93.22,78.62 93.15,78.56
N$121
  Top 0.254: IC6.11 31.75,51.7 29.34,54.11 26.29,54.11 21.59,58.81 21.59,62.49 20.07,64.02 16.76,64.02 15.11,62.37 15.11,53.22 R25.1
N$122
  Top 0.254: IC1.33 R12.1
NAVWARN
  Top 0.254: IC6.7 34.29,34.3 IC1.38
PH115
  Top 0.254: R59.1 IC15.1 65.15,58.43 66.29,57.29 78.23,57.29 R67.1
  Bottom 0.254: R67.1 IC16.1 89.53,63.51 IC16.12 93.22,69.73 119.76,69.73 123.44,66.05 IC17.11
PHCOS
  Top 0.254: R82.1 R83.1 IC18.1
  Bottom 0.254: IC16.9 97.54,66.05 99.31,64.27 107.82,64.27 108.2,64.65 110.36,64.65 111.51,63.51 R82.1
PHHDG
  Top 0.254: IC15.7 R65.1 R66.1 77.98,59.57 80.14,59.57 86.61,66.05 IC16.13
PHSIN
  Top 0.254: R85.1 R84.1 IC18.7 | IC16.2 87,58.81 93.47,65.29 93.47,67.07 94.23,67.83 97.92,67.83 IC16.8
  Bottom 0.254: R84.1 148.84,63.51 147.7,62.37 98.68,62.37 96.01,65.03 96.01,67.07 96.77,67.83 97.92,67.83 IC16.8
PWRON
  Top 0.254: IC1.22 82.93,26.68 85.09,28.84 89.41,28.84 99.19,38.62 99.19,41.03 105.28,47.13 107.06,47.13 111.89,51.95 111.89,53.73 114.3,56.14 121.16,56.14 122.68,57.67 122.68,62.37 IC17.10
REF115
  Top 0.254: R39.2 10.16,74.94 REF2.1
SIG115
  Top 0.254: R30.2 R29.2 43.18,55 40.51,57.67 40.51,59.83 36.83,63.51 IC14.13 IC14.14 28.57,71.77 R50.2
SPARE24
  Top 0.254: IC1.40 IC6.2
SPI_CLK  (via drill 0.3)
  Top 0.254: IC3.3 103.89,6.36 105.66,8.14 111.63,8.14 | 111.63,8.14 113.79,8.14 IC4.3 | IC2.3 103.89,19.06 105.66,20.84 109.73,20.84 110.36,20.2 110.87,20.2 111.63,19.44 111.63,8.14 | IC1.34 52.45,26.68 54.86,24.27 v79.25,24.27
  Bottom 0.254: v79.25,24.27 85.72,24.27 92.71,17.28 101.73,17.28 IC2.3
SPI_DAT
  Bottom 0.254: IC4.4 116.33,8.14 110.11,8.14 108.33,6.36 IC3.4 99.82,12.58 99.82,15 99.89,15.06 | IC2.4 105.66,19.06 103.12,16.52 101.35,16.52 99.89,15.06 | IC1.26 72.77,26.68 83.69,15.76 99.19,15.76 99.89,15.06
TO_FLAG
  Top 0.254: IC6.15 21.59,46.62 25.53,42.68 25.53,40.52 IC1.39
USB_DM
  Top 0.254: IC1.23 80.01,24.01 79.5,23.51 53.72,23.51 53.59,23.63 33.66,23.63 29.08,19.06 14.99,19.06 USB.2
USB_DP
  Bottom 0.254: IC1.24 77.09,26.68 75.31,28.46 72.01,28.46 70.99,27.44 70.99,25.66 58.55,13.22 51.69,13.22 50.67,12.2 50.67,10.42 49.4,9.15 27.43,9.15 21.46,15.12 21.46,15.63 19.18,17.92 13.97,17.92 12.95,18.93 USB.3
USBDOA
  Bottom 0.254: IC1.7 52.07,8.65 49.91,6.49 29.08,6.49 U/D.2 R2.1
VIN
  Bottom 0.254: IC6.8 36.45,41.92 27.56,33.03 V+.2

## Text on the board
tNames: HDGAMP | HDGADC | SINAMP | SINADC | COSAMP | COSADC | COS | SIN | WX | 115 | GND | HDG | GND | CRS | CDIMAX | T/F | GND | CDI | N | S3 | GND | -5V | 5V | SYM | S2 | GND | HSI | +IN | IN | #2 | S1 | +5V | Henkie / 2019 | GND | S3 | CLK | S2 | RST | S1 | DAT | JLCJLCJLCJLC | GND | A | B